# EAGLE design Analog_PID_Controller (EAGLE 8.6.3)
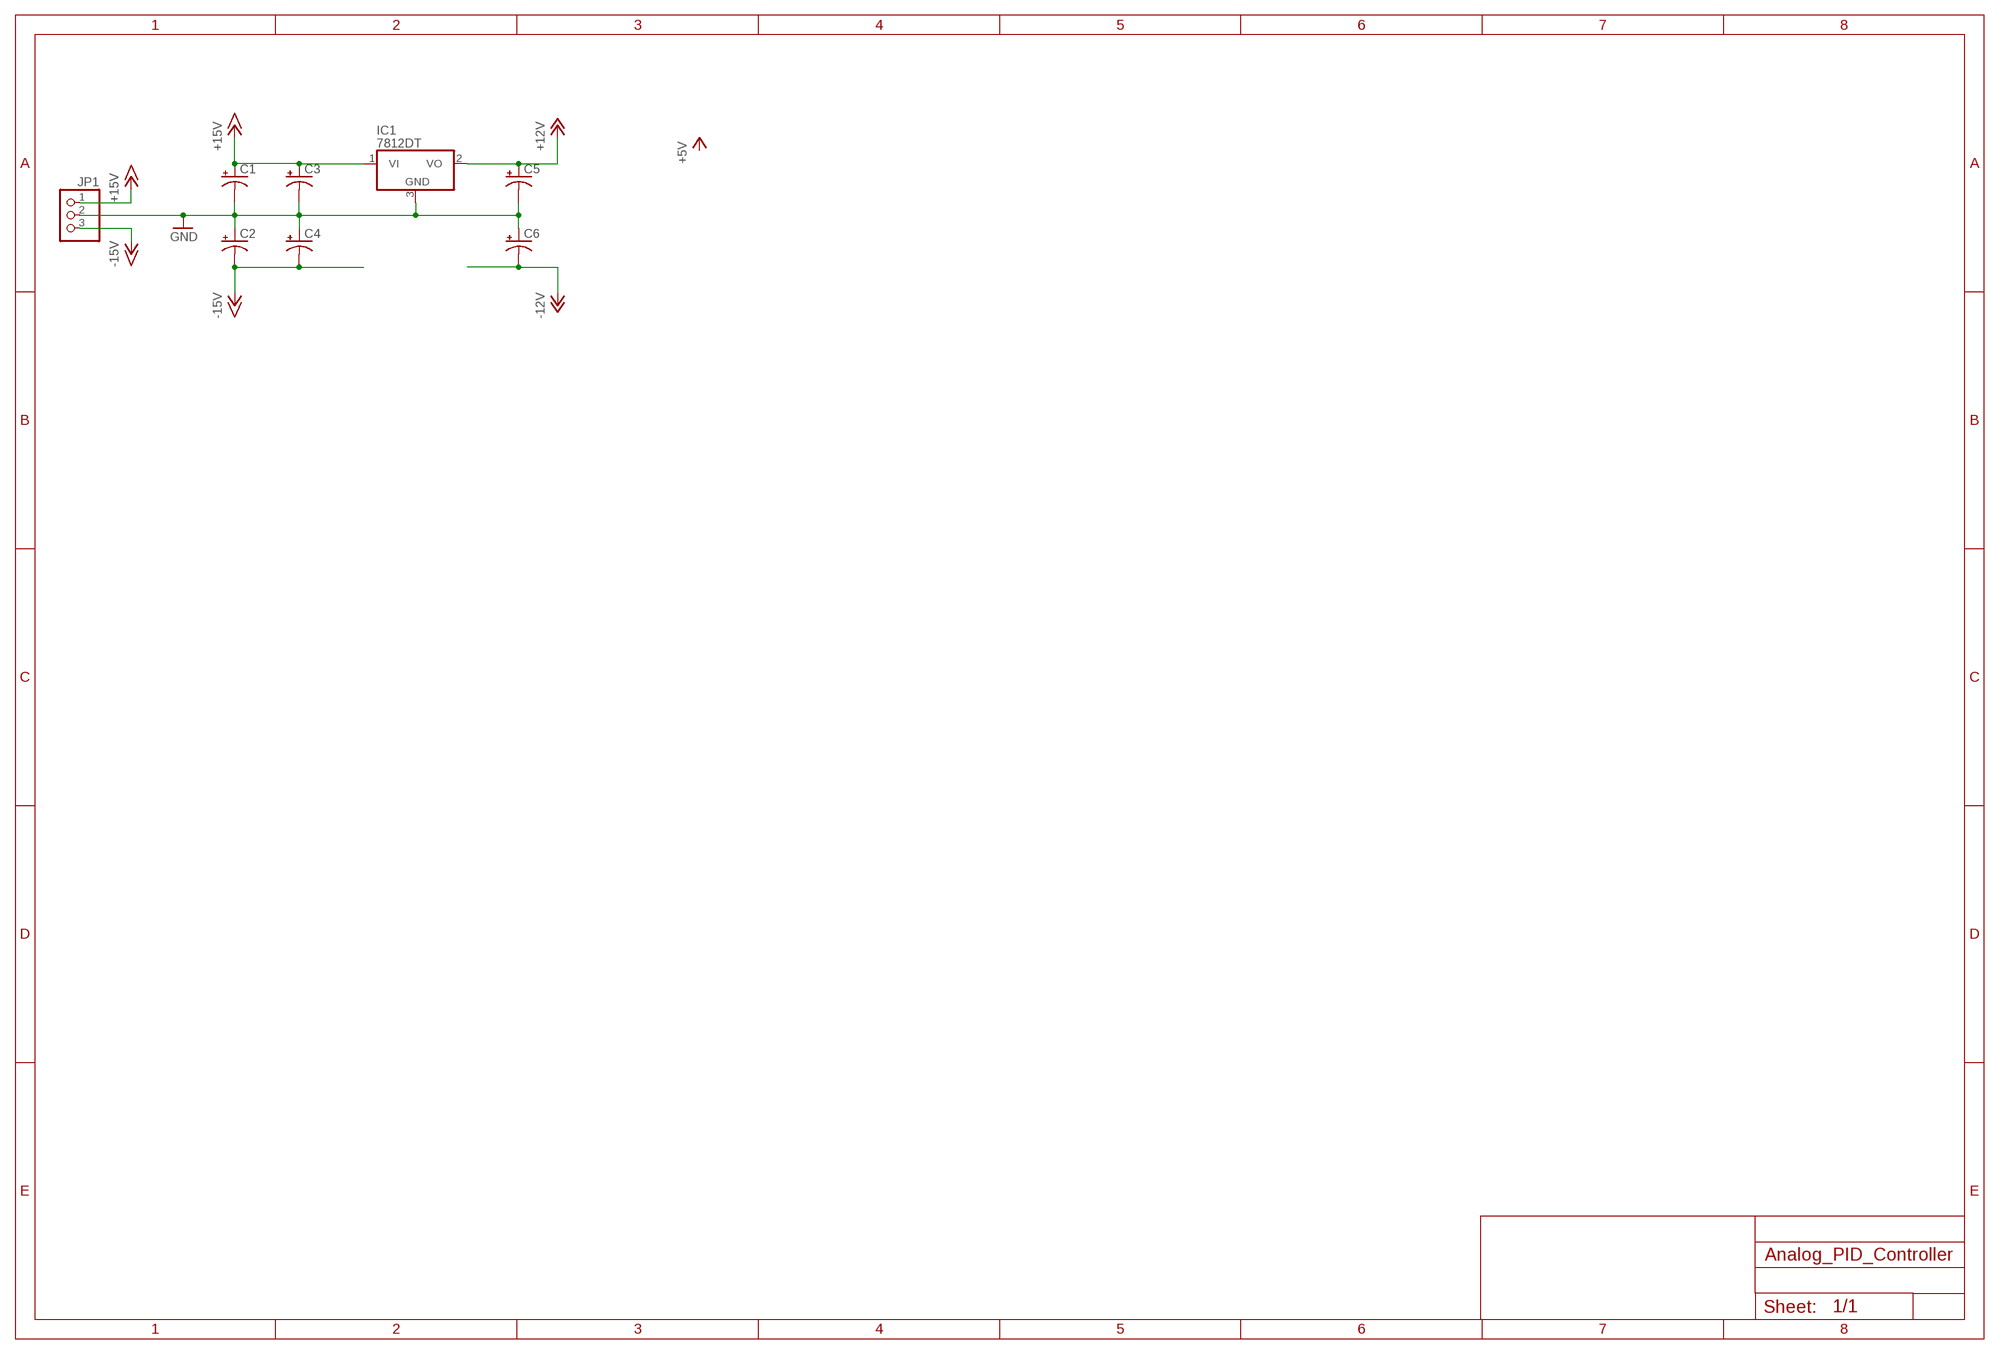
[diagram p0: schematic, sheet 1]

## Parts
C1  CPOL-USD  [PANASONIC_D]
C2  CPOL-USD  [PANASONIC_D]
C3  CPOL-USD  [PANASONIC_D]
C4  CPOL-USD  [PANASONIC_D]
C5  CPOL-USD  [PANASONIC_D]
C6  CPOL-USD  [PANASONIC_D]
IC1  7812DT  [TO252]
JP1  PINHD-1X3/90  [1X03/90]

## Nets
+12V: C5.+ IC1.2(VO)
+15V: C1.+ C3.+ IC1.1(VI) JP1.1
-12V: C6.-
-15V: C2.- C4.- JP1.3
GND: C1.- C2.+ C3.- C4.+ C5.- C6.+ IC1.3(GND) JP1.2

## Library data of the parts
C1-C6 = rcl:CPOL-US: POLARIZED CAPACITOR, American symbol; SPICEPREFIX: C
IC1 = linear:78*: Positive VOLTAGE REGULATOR Source: http://cache.national.com/ds/LM/LM78L05.pdf http://www.fairchildsemi.com/ds/LM/LM7805.pdf
JP1 = pinhead:PINHD-1X3: PIN HEADER

## Board
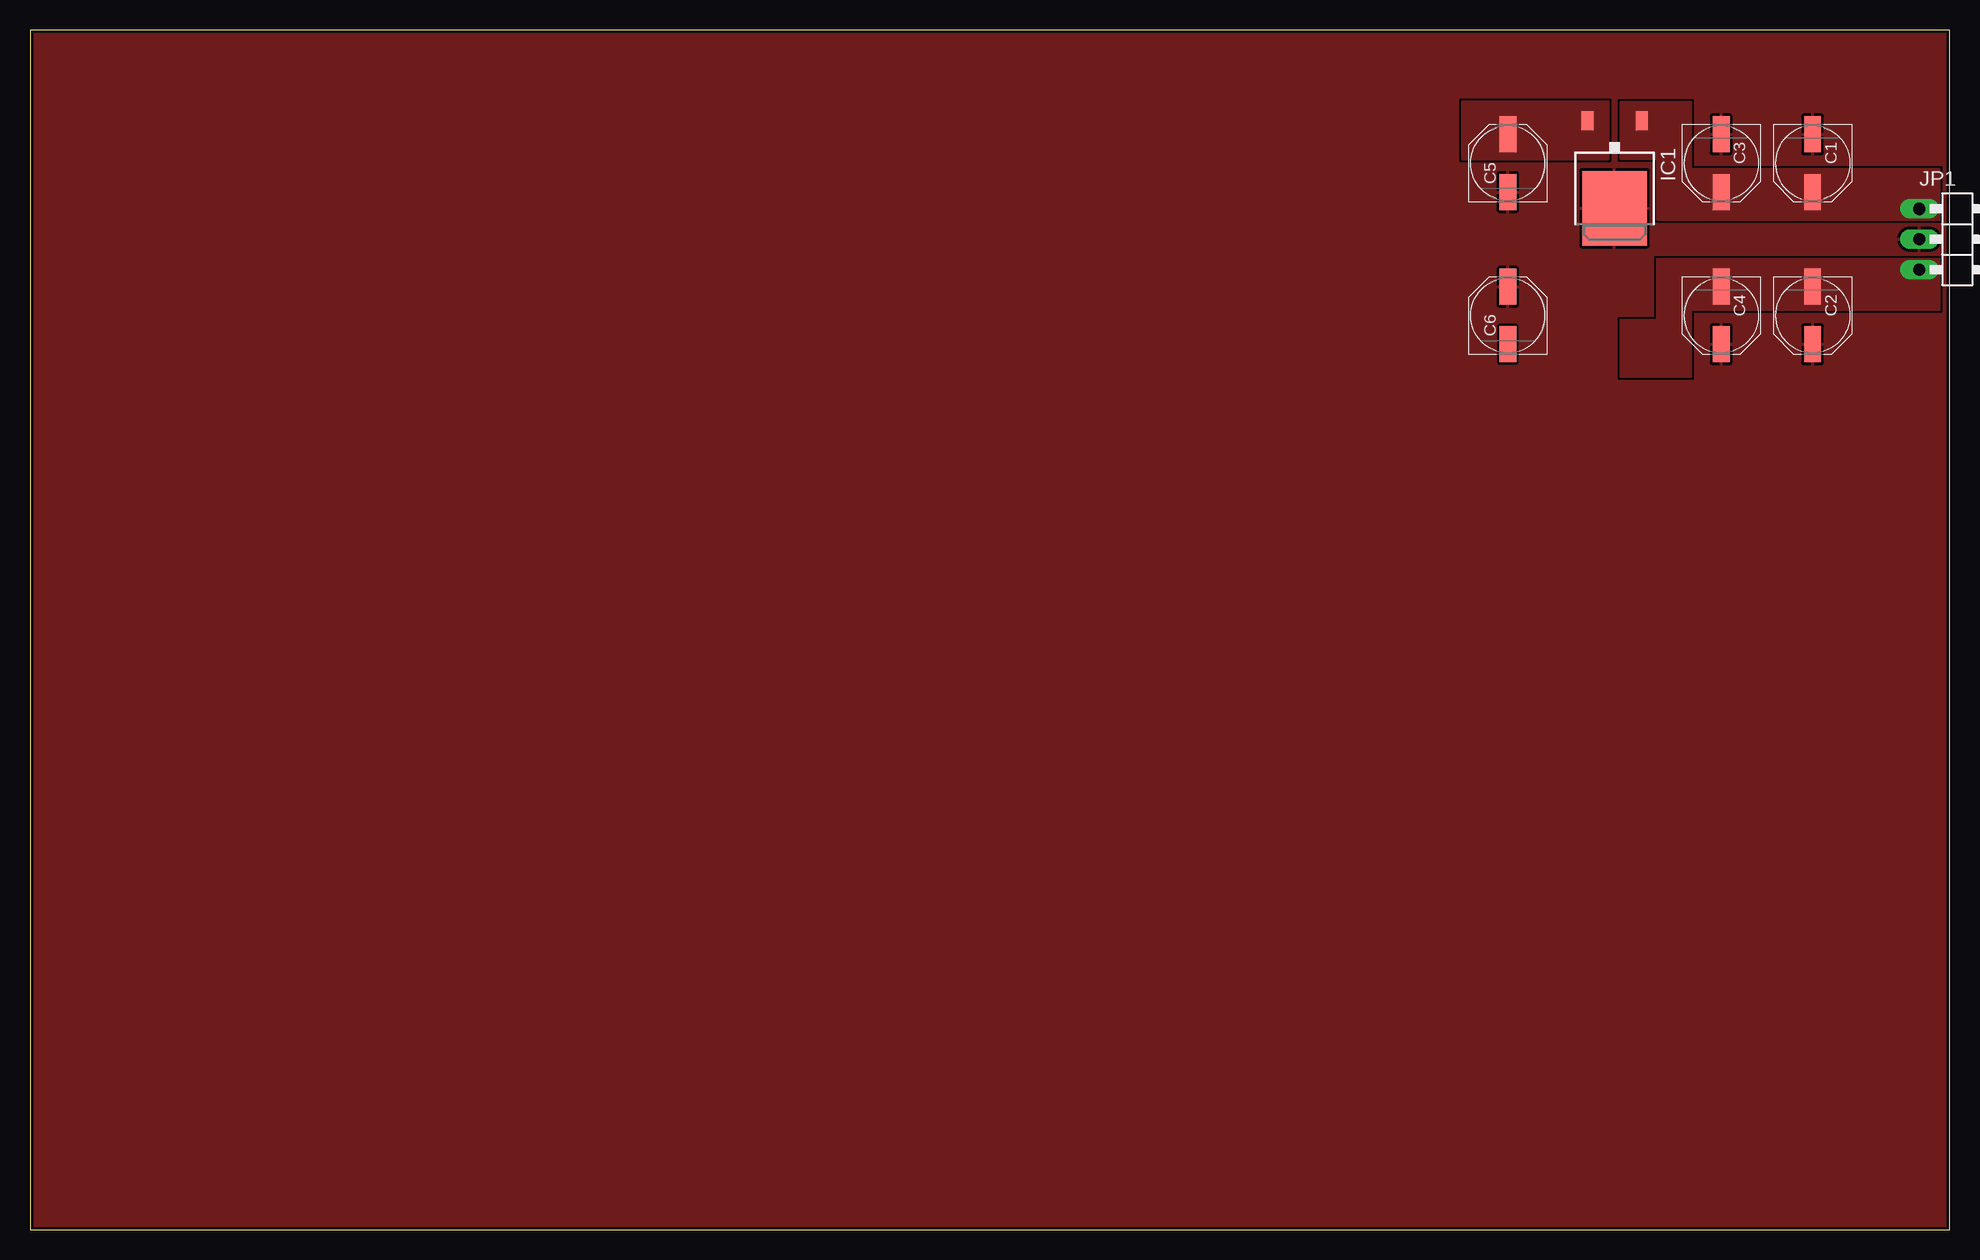
[diagram p1: board, top side]

Size 160 x 100 mm. Coordinates in mm from the lower left corner, seen from the top.
Outline: 0,0 160,0 160,100 0,100 0,0
Copper layers (1*16): Top 0.035mm / dielectric 1.5mm / Bottom 0.035mm
Design rules "SparkFun": minimum track width 8mil, minimum drill 13mil, track to track 8mil, track to pad 8mil, pad to pad 8mil, via to via 8mil, smd to smd 8mil, copper to edge 10mil, drill to drill 8mil, minimum pad ring 12mil, minimum via ring 10mil, stop-mask expansion 4mil, vias tented up to drill 25mil, thermal gap 10mil

### Footprints (pad centres in the part's own frame; a part is rotated, then mirrored left to right if it is on the bottom)
PANASONIC_D = smd 3 x 1.4: + 2.4,0; - -2.4,0
TO252 = smd 1 x 1.6: 1 -2.28,-4.8; 2 2.28,-4.8 | smd 5.4 x 6.2: 3 0,2.5
1X03/90 = drill 1.016 long: 1 -2.54,-3.81; 2 0,-3.81; 3 2.54,-3.81

### Placement (x,y rotation side)
C1  148.59,88.9 270 top
C2  148.59,76.2 270 top
C3  140.97,88.9 270 top
C4  140.97,76.2 270 top
C5  123.19,88.9 90 top
C6  123.19,76.2 90 top
IC1  132.08,87.63 180 top
JP1  161.29,82.55 270 top

### Tracks (layer width: path | path; a pad name or v marks a point on that pad's centre or on a via)
+12V
  pour Top (no thermals): 131.57,89.28 131.57,93.98 119.38,93.98 119.38,89.28
+15V
  pour Top (no thermals): 159.13,84.2 159.13,88.39 138.43,88.39 138.43,93.98 132.59,93.98 132.59,89.28 135.64,89.28 135.64,84.2
-15V
  pour Top (no thermals): 159.13,80.9 159.13,76.71 138.43,76.71 138.43,71.12 132.59,71.12 132.59,75.82 135.64,75.82 135.64,80.9
GND
  pour Top (rank 6): 186.69,115.57 186.69,-16.51 -24.13,-16.51 -24.13,115.57